# EasyEDA schematic PCBv2.5a.json

## Sheets
1 Headers: TITLE: Sheet_2; REV: 1.0; Date: 2020-05-18; Sheet: 1/1; Drawn By: jacopo.franco333; Company: Your Company
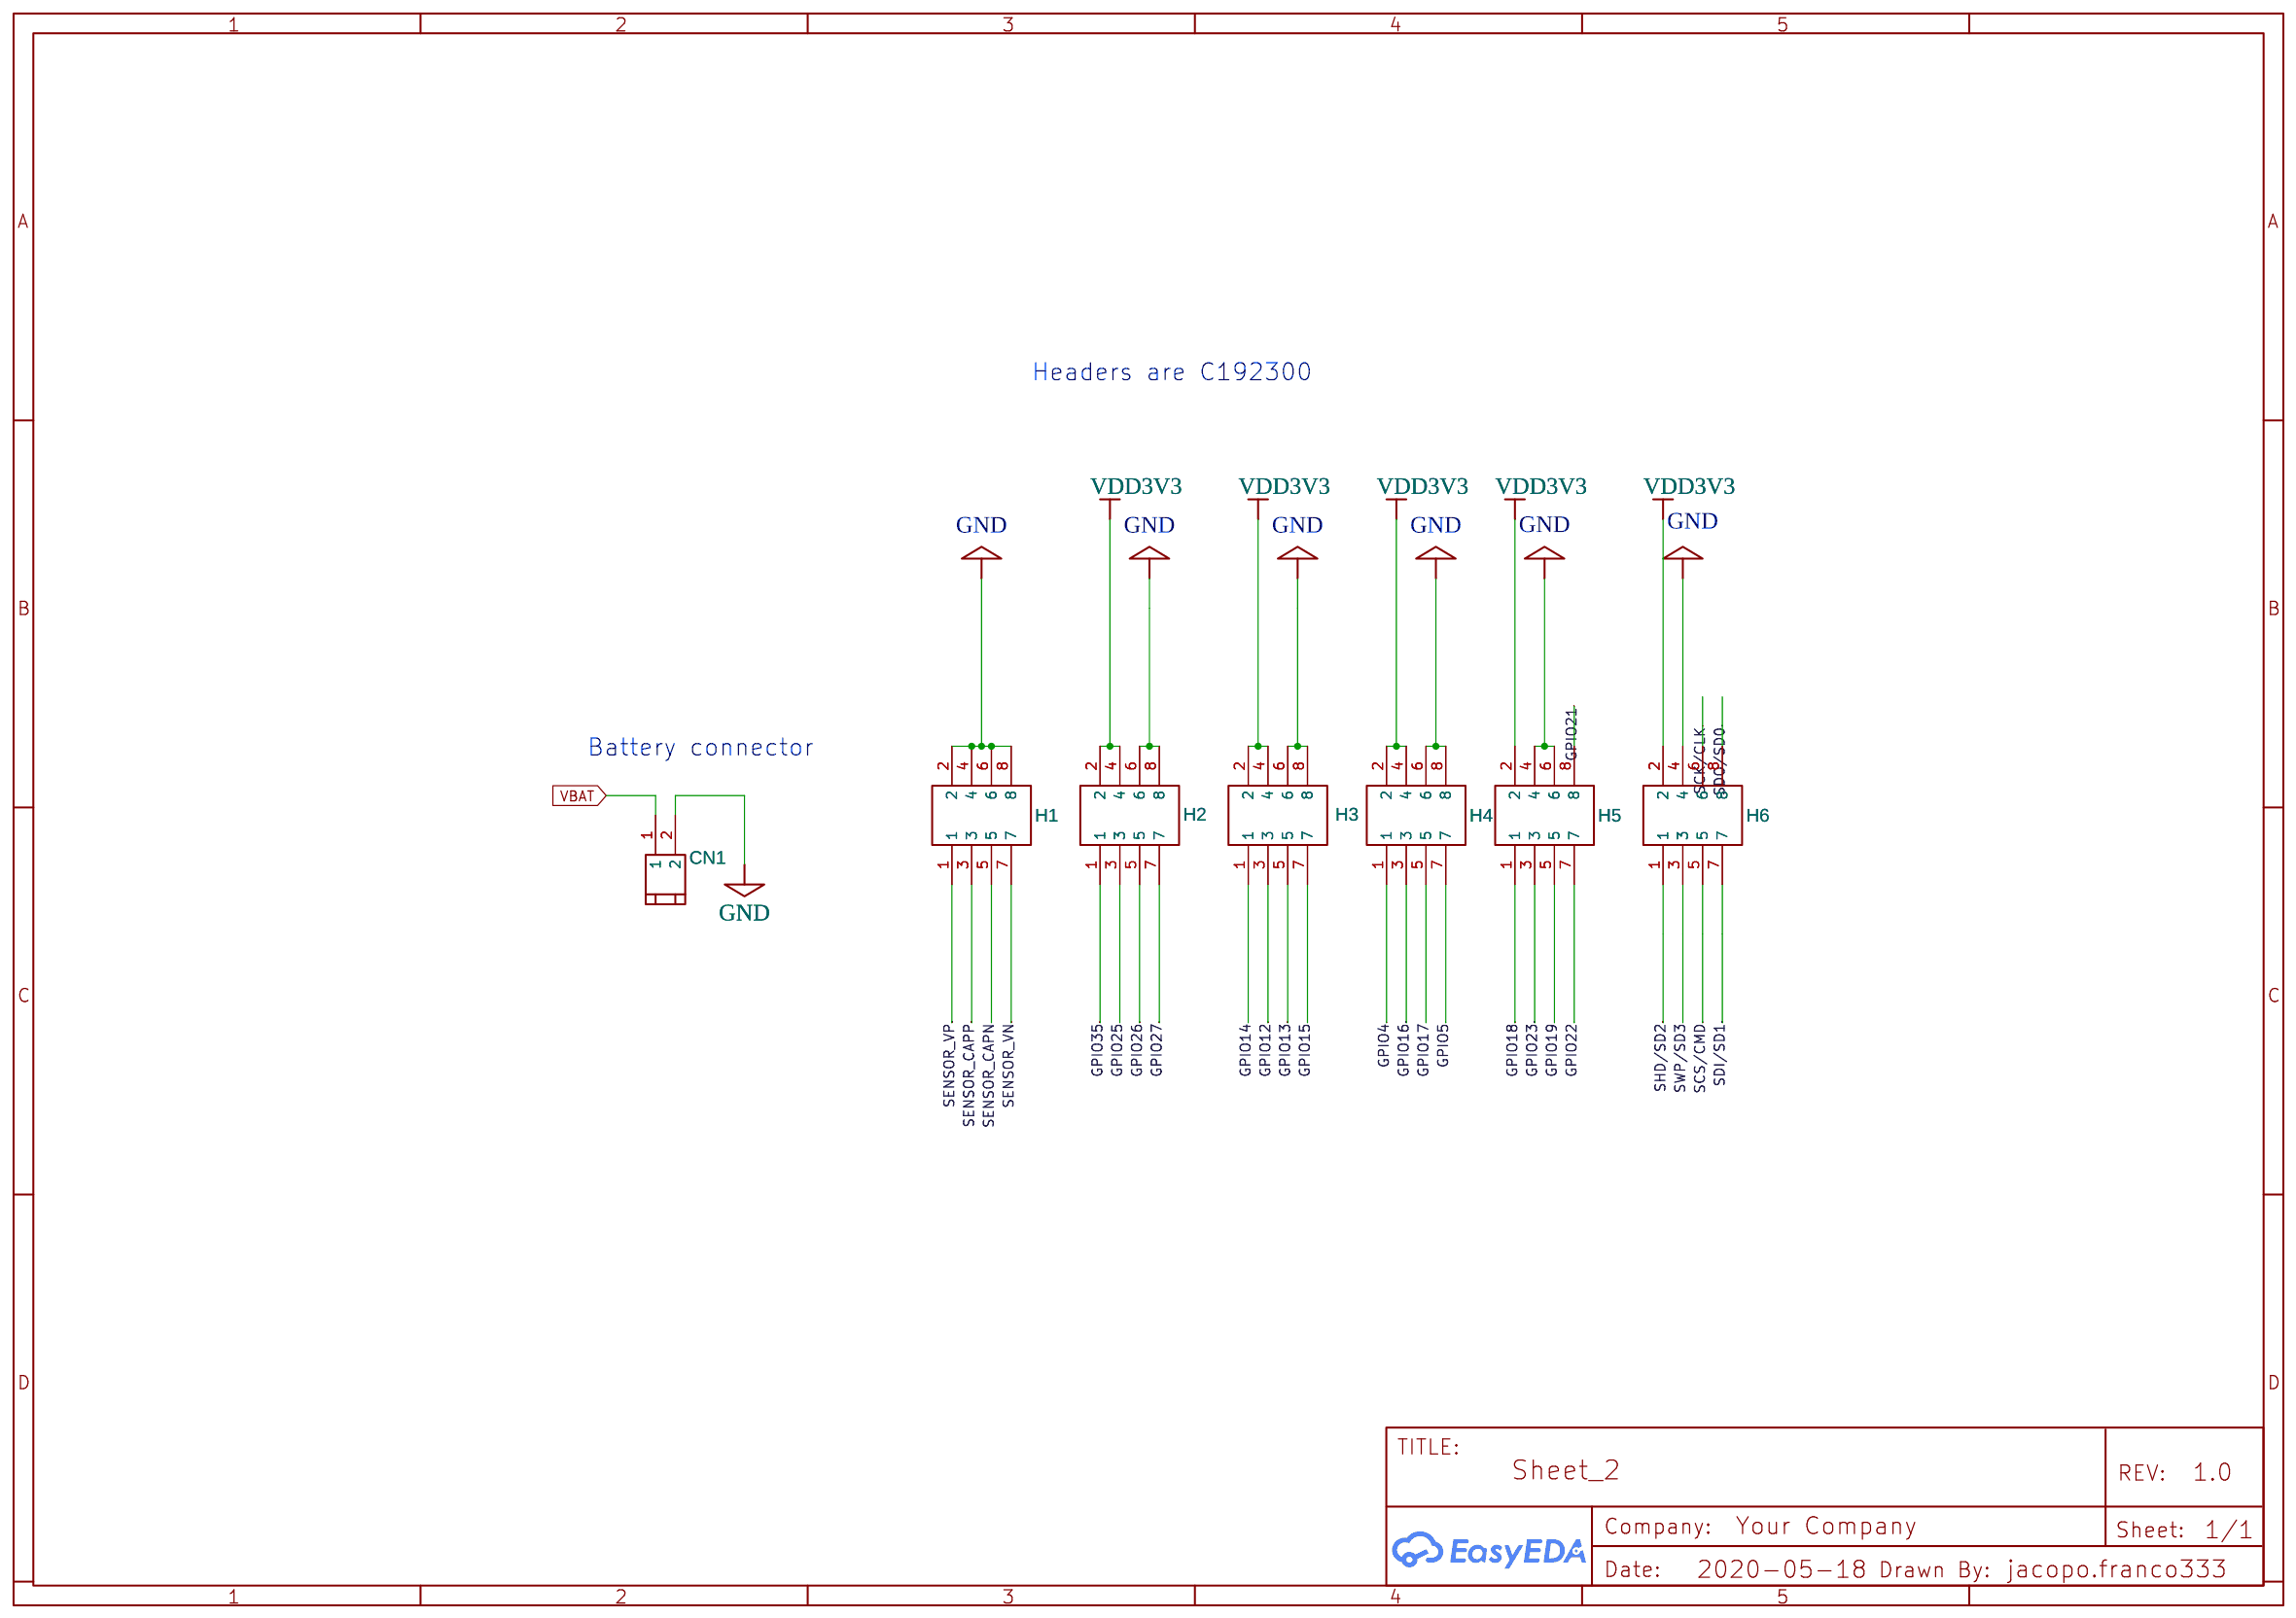
[diagram p0: Headers]
2 ESP32: TITLE: Sheet_1
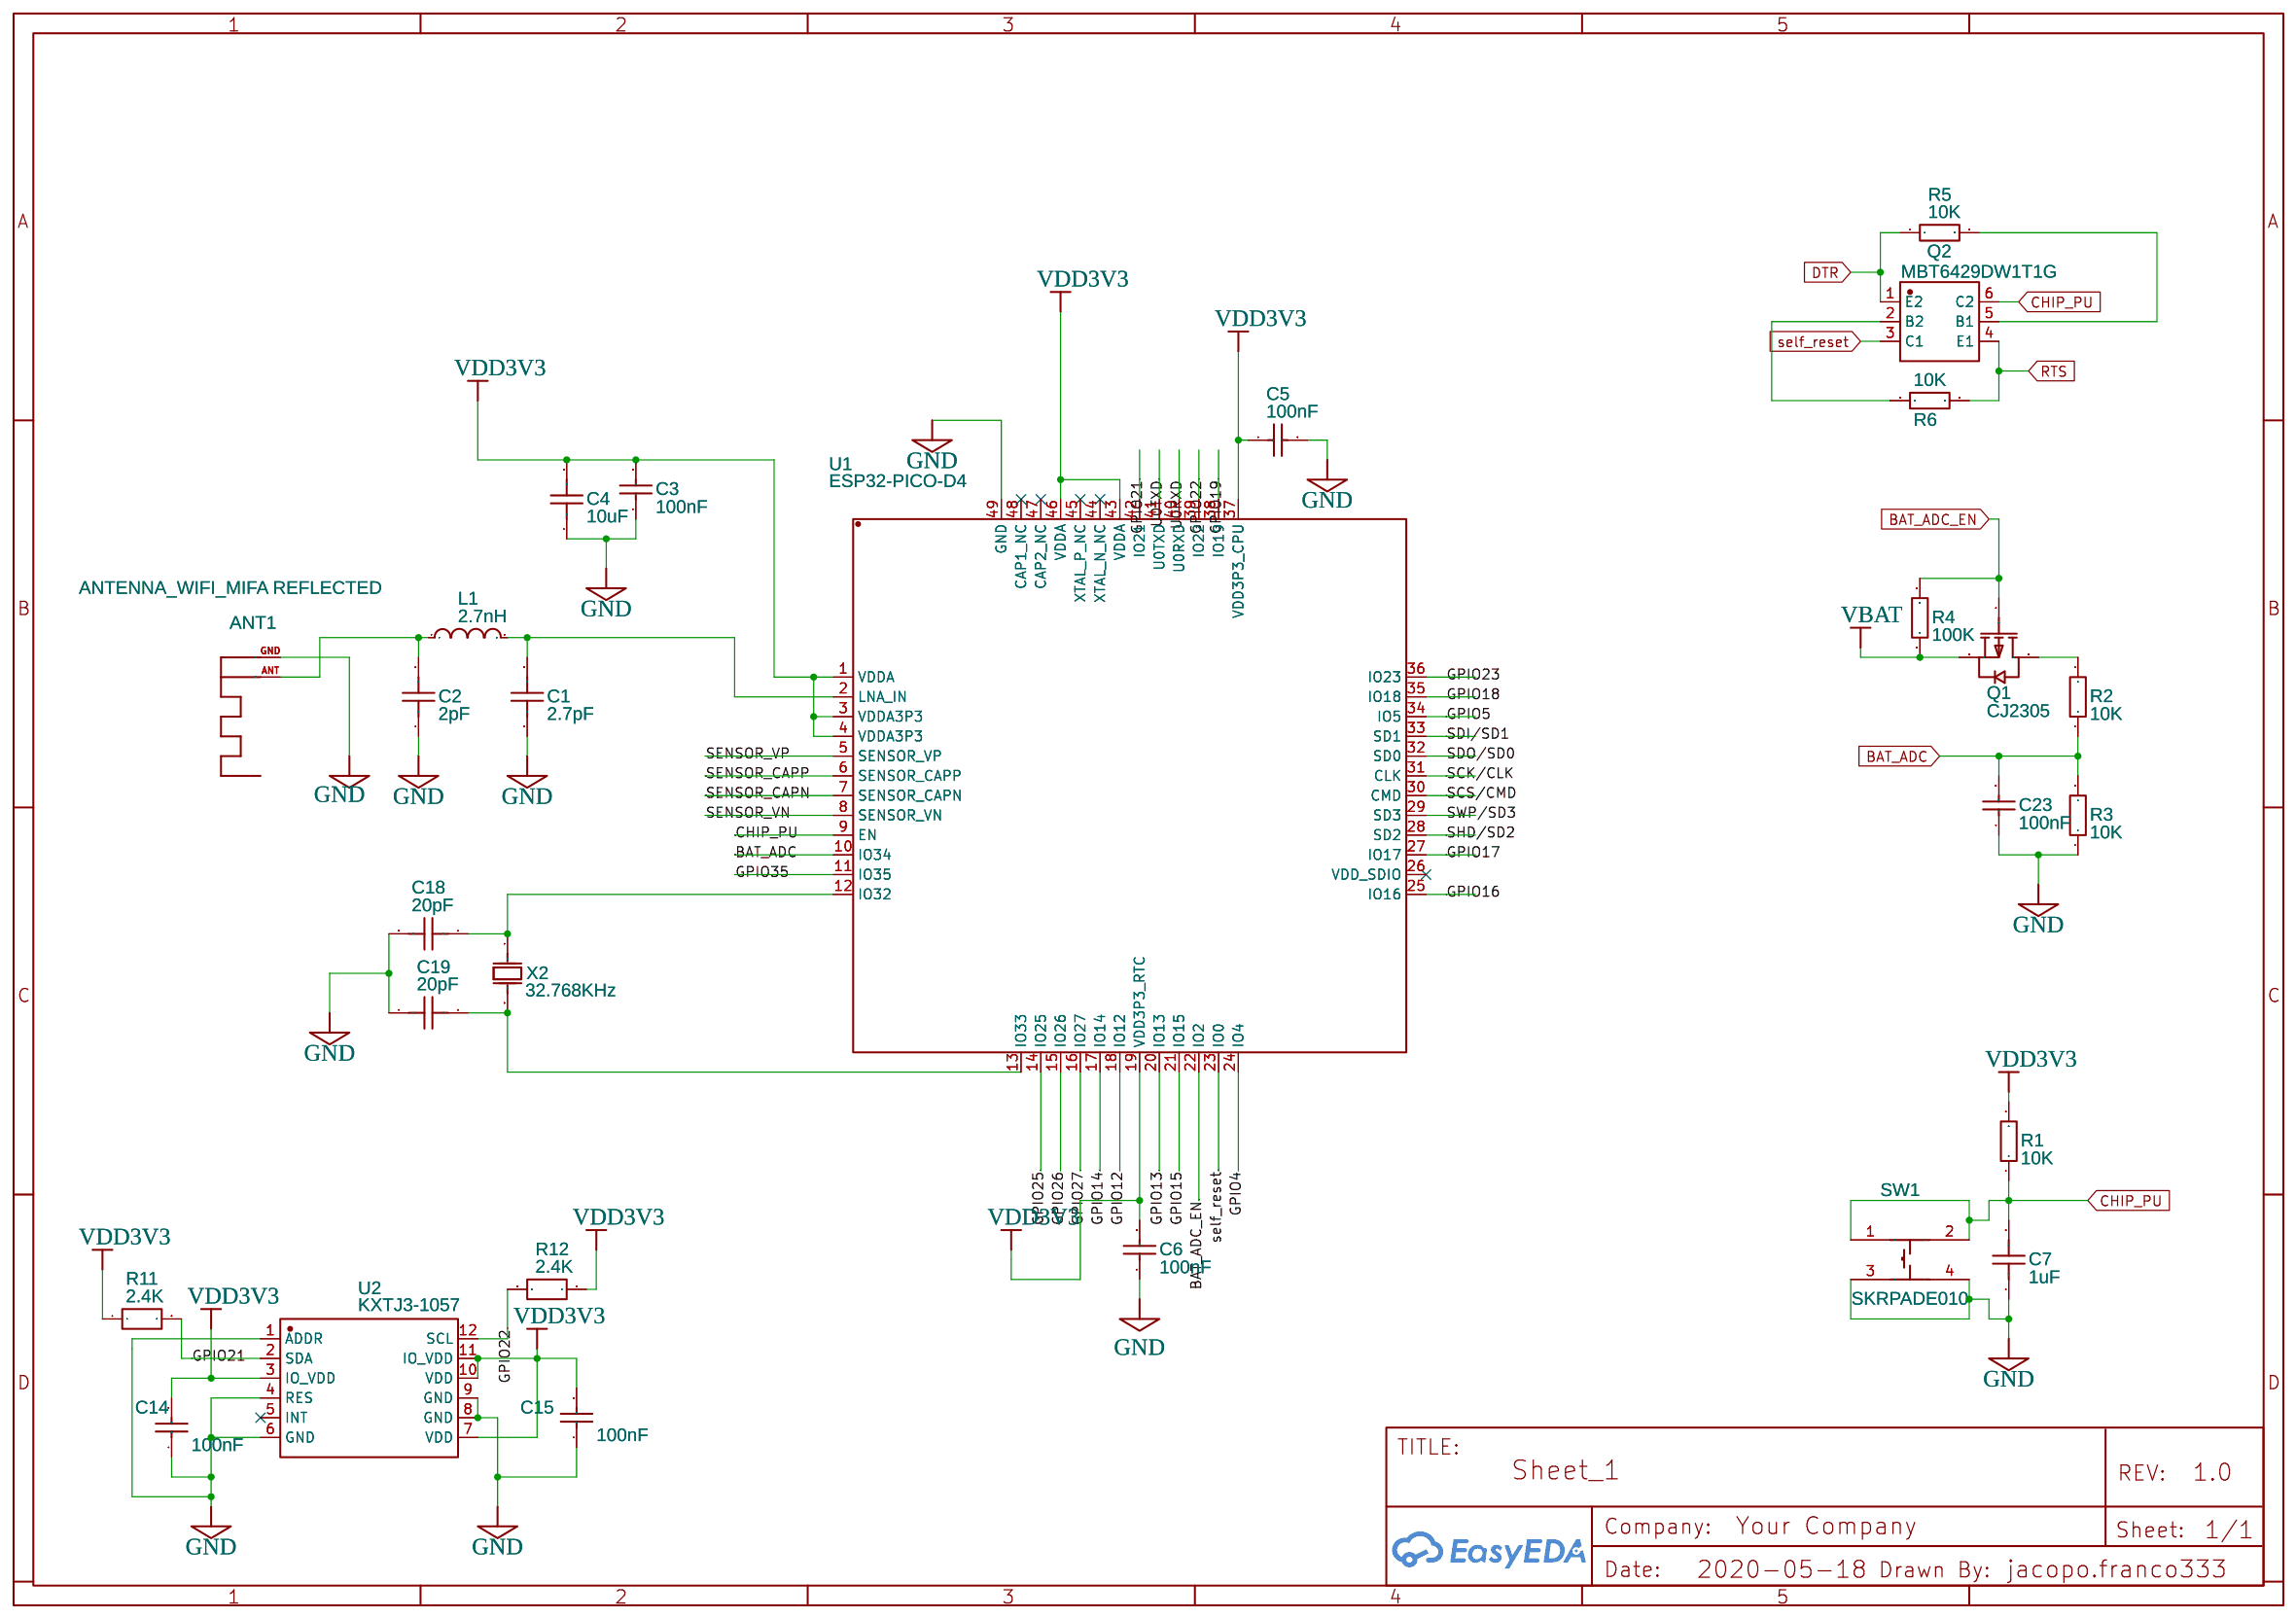
[diagram p1: ESP32]
3 Power, USB: TITLE: Sheet_1
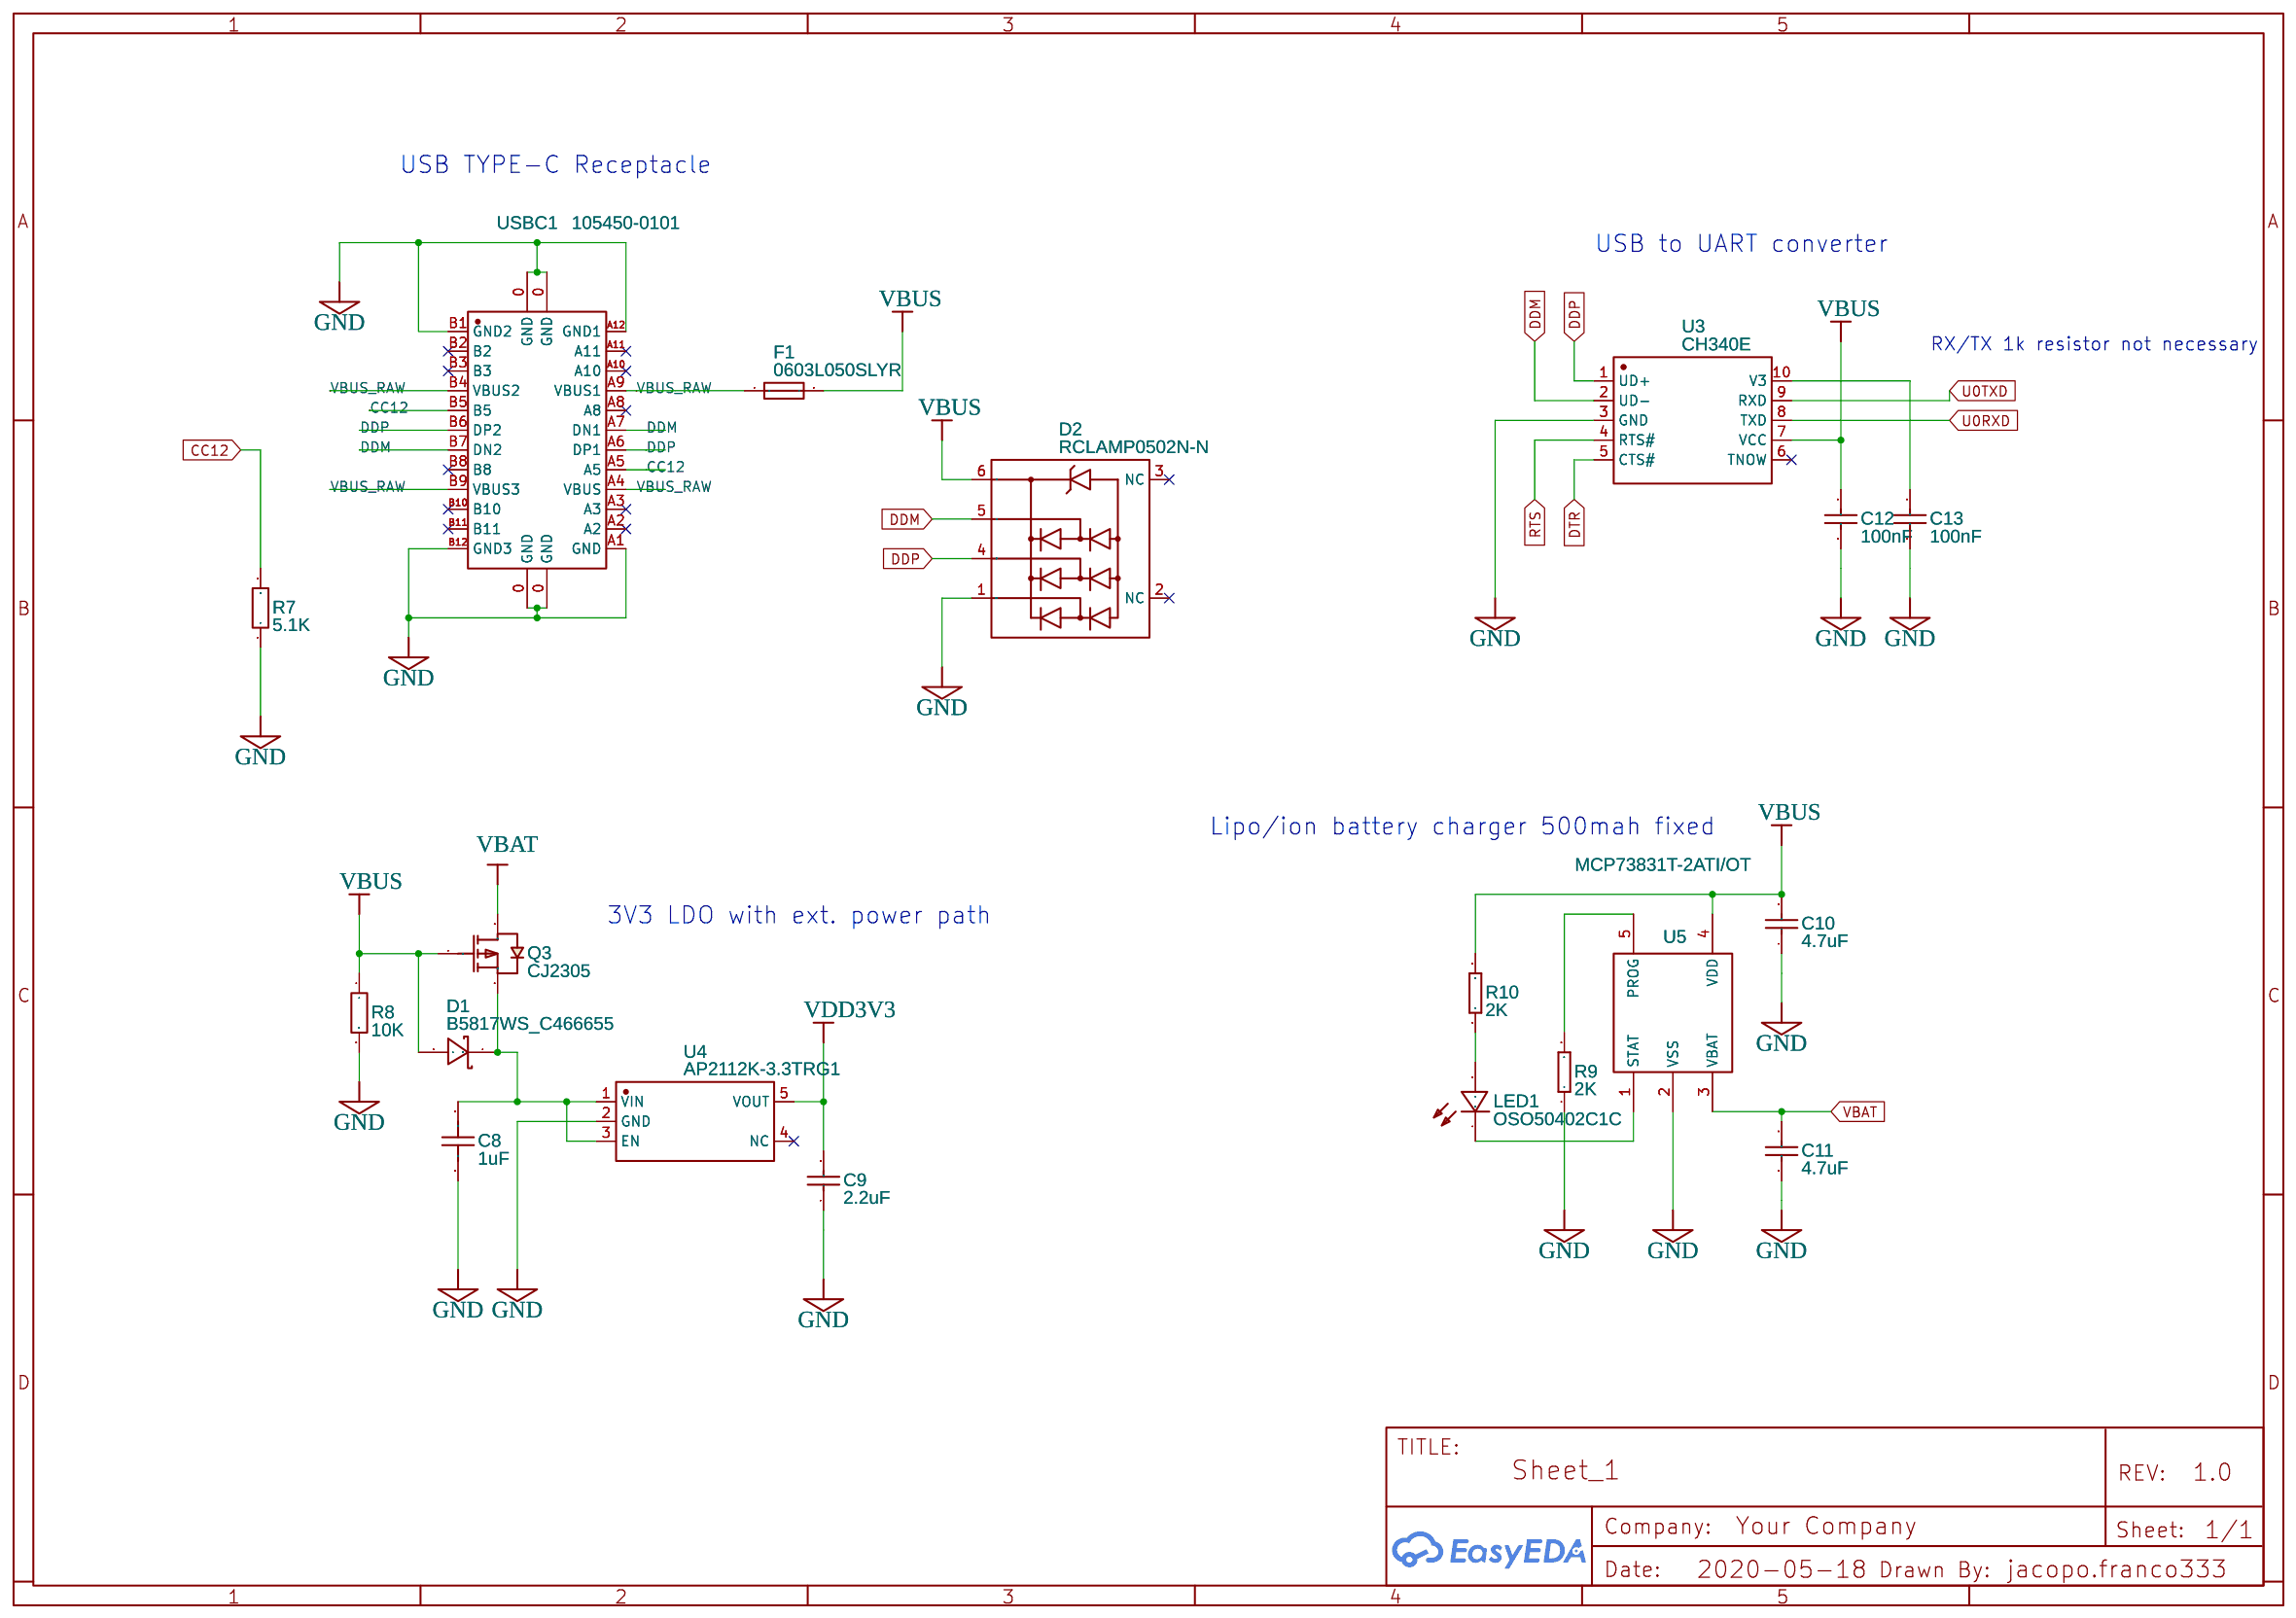
[diagram p2: Power, USB]

## Parts
sheet ESP32
ANT1  ANTENNA_WIFI_MIFA REFLECTED  [WIFI ANTENNA MIFA INVERTED F ANTENNA REFLECTED2]
C1  2.7pF  [C0402]
C2  2pF  [C0402]
C3  100nF  [C0402]
C4  10uF  [C0402]
C5  100nF  [C0402]
C6  100nF  [C0402]
C7  1uF  [C0402]
C14  100nF  [C0402]
C15  100nF  [C0402]
C18  20pF  [C0402]
C19  20pF  [C0402]
C23  100nF  [C0402]
L1  2.7nH  [L0402]
Q1  CJ2305  [SOT-23-3_L2.9-W1.3-P1.90-LS2.4-BR]
Q2  MBT6429DW1T1G  [SC-70-6_L2.2-W1.3-P0.65-LS2.1-BL]
R1  10K  [R0402]
R2  10K  [R0402]
R3  10K  [R0402]
R4  100K  [R0402]
R5  10K  [R0402]
R6  10K  [R0402]
R11  2.4K  [R0402]
R12  2.4K  [R0402]
SW1  SKRPADE010  [KEY-SMD_4P-L4.2-W3.2-P2.20-LS4.6]
U1  ESP32-PICO-D4  [QFN-48_L7.0-W7.0-P0.50-BL-EP5.1]
U2  KXTJ3-1057  [LGA-12_L2.0-W2.0-P0.50-BL]
X2  32.768KHz  [OSC-SMD_L3.2-W1.5]
sheet Headers
CN1  XH-2PWB  [CONN-SMD_2P-P2.50_XH-2PWB]
H1  95278-801A08LF  [HDR-SMD_8P-P2.54-V-R2-C4-S7.3]
H2  95278-801A08LF  [HDR-SMD_8P-P2.54-V-R2-C4-S7.3]
H3  95278-801A08LF  [HDR-SMD_8P-P2.54-V-R2-C4-S7.3]
H4  95278-801A08LF  [HDR-SMD_8P-P2.54-V-R2-C4-S7.3]
H5  95278-801A08LF  [HDR-SMD_8P-P2.54-V-R2-C4-S7.3]
H6  95278-801A08LF  [HDR-SMD_8P-P2.54-V-R2-C4-S7.3]
sheet Power, USB
C8  1uF  [C0402]
C9  2.2uF  [C0402]
C10  4.7uF  [C0402]
C11  4.7uF  [C0402]
C12  100nF  [C0402]
C13  100nF  [C0402]
D1  B5817WS_C466655  [SOD-323_L1.8-W1.3-LS2.5-RD]
D2  RCLAMP0502N-N  [SLP1210N6_L1.2-W1.0-P0.40-BL]
F1  0603L050SLYR  [F0603]
LED1  OSO50402C1C  [LED0402-RD]
Q3  CJ2305  [SOT-23-3_L2.9-W1.3-P1.90-LS2.4-BR]
R7  5.1K  [R0402]
R8  10K  [R0402]
R9  2K  [R402]
R10  2K  [R402]
U3  CH340E  [MSOP-10_L3.0-W3.0-P0.50-LS5.0-BL]
U4  AP2112K-3.3TRG1  [SOT-25-5_L3.0-W1.8-P0.95-LS3.0-BL]
U5  MCP73831T-2ATI/OT  [SOT-23-5_L3.0-W1.7-P0.95-LS2.8-BL]
USBC1  105450-0101  [USB-C-SMD_TYPE-C-USB-18]

## Library data of the parts
ANT1 = ANTENNA_WIFI_MIFA REFLECTED: Contributor: Joshua Lloyd
C1 = CC0402CRNPO9BN2R7: Supplier: LCSC; Supplier Part: C277484; Manufacturer: YAGEO; Contributor: LCSC
C2 = GJM1555C1H2R0WB01D: Supplier: LCSC; Manufacturer: MuRata; Supplier Part: C88885
C3 C5 C6 C12-C15 C23 = GCM155R71E104KE02D: Supplier: LCSC; Manufacturer: MuRata; Supplier Part: C126527
C4 = GRM155R61A106ME21D: Supplier: LCSC; Supplier Part: C324476; Manufacturer: Murata Electronics; Contributor: LCSC
C7 C8 = CL05A105KA5NQNC: Supplier: LCSC; Manufacturer: SAMSUNG; LCSC Assembly: Yes; Supplier Part: C52923; SMT Type: Basic
C18 C19 = GCM1555C1H200FA16D: Supplier: LCSC; Supplier Part: C437436; Manufacturer: Murata Electronics; Contributor: LCSC
L1 = MLG1005S2N7BT000: Supplier: LCSC; Supplier Part: C275282; Manufacturer: TDK; Contributor: LCSC
Q1 Q3 = CJ2305: Supplier: LCSC; Manufacturer: CJ; image: //image.lceda.cn/szlcsc/C8549.jpg; Supplier Part: C8549; LCSC Assembly: Yes; SMT Type: Extend
Q2 = MBT6429DW1T1G: Supplier: LCSC; Supplier Part: C463297; Manufacturer: ON Semicon; Contributor: LCSC
R1-R3 R5 R6 R8 = RC0402FR-0710KL: Supplier: LCSC; Manufacturer: YAGEO; Supplier Part: C60490
R4 = 0402WGJ0104TCE: Supplier: LCSC; Manufacturer: UniOhm; Supplier Part: C25530
R11 R12 = 0402WGD2401TCE: Supplier: LCSC; Supplier Part: C407742; Manufacturer: Uniroyal Elec; Contributor: LCSC
SW1 = SKRPADE010: Supplier: LCSC; Manufacturer: ALPS; Contributor: LCSC; Supplier Part: C127488
U1 = ESP32-PICO-D4: Supplier: LCSC; Supplier Part: C193707; Manufacturer: Espressif Systems; Contributor: LCSC; LCSC Assembly: Yes; SMT Type: Extend
U2 = KXTJ3-1057: Supplier: LCSC; Supplier Part: C442603; Manufacturer: ROHM Semicon; Contributor: LCSC; LCSC Assembly: Yes; SMT Type: Extend
X2 = AH03270014: Supplier: LCSC; Supplier Part: C409356; Manufacturer: TXC Corp; Contributor: LCSC
CN1 = XH-2PWB: Supplier: LCSC; Manufacturer: BOOMELE; image: //image.lceda.cn/szlcsc/C64520.jpg; Supplier Part: C64520
H1-H6 = 95278-801A08LF: Supplier: LCSC; Supplier Part: C192300; Manufacturer: Amphenol ICC; Contributor: LCSC
C9 = GRM155R61A225KE95D: Supplier: LCSC; Manufacturer: MuRata; Supplier Part: C77002
C10 C11 = GRM155R61A475KEAAD: Supplier: LCSC; Manufacturer: MuRata; Supplier Part: C77004
D1 = B5817WS_C466655: Supplier: LCSC; Supplier Part: C466655; Manufacturer: High Diode; Manufacturer Part: B5817WS; Contributor: LCSC
D2 = RCLAMP0502N-N: Supplier: LCSC; Supplier Part: C344005; Manufacturer: Bourne Semicon (Shenzhen); Manufacturer Part: Rclamp0502N-N; Contributor: LCSC
F1 = 0603L050SLYR: Supplier: LCSC; Supplier Part: C207014; Manufacturer: Littelfuse; Contributor: LCSC
LED1 = OSO50402C1C: Supplier: LCSC; Supplier Part: C268301; Manufacturer: OptoSupply; Contributor: LCSC
R7 = AR02DTD5101: Supplier: LCSC; Supplier Part: C319557; Manufacturer: Viking Tech; Contributor: LCSC
R9 R10 = RESISTOR-0402: Contributor: DangerousPrototype; Supplier Part: C478870
U3 = CH340E: Supplier: LCSC; Manufacturer: WCH; Supplier Part: C99652; LCSC Assembly: Yes; SMT Type: Extend
U4 = AP2112K-3.3TRG1: Supplier: LCSC; Manufacturer: DIODES; Contributor: LCSC; Supplier Part: C51118; LCSC Assembly: Yes; SMT Type: Extend
U5 = MCP73831T-2ATI/OT: Supplier: LCSC; Manufacturer: MICROCHIP; image: //image.lceda.cn/szlcsc/C14879.jpg; Supplier Part: C14879; LCSC Assembly: Yes; SMT Type: Extend
USBC1 = 105450-0101: Supplier: LCSC; Supplier Part: C134092; Manufacturer: MOLEX; Contributor: LCSC

## Nets
GND: ANT1.GND C1.1 C2.1 C3.1 C4.1 C5.2 C6.1 C7.1 C8.1 C9.1 C10.1 C11.1 C12.1 C13.1 C14.1 C15.1 C18.2 C19.1 C23.1 CN1.2 D2.1(GND) H1.2 H1.4 H1.6 H1.8 H2.6 H2.8 H3.6 H3.8 H4.6 H4.8 H5.4 H5.6 H6.4 R3.1 R7.1 R8.2 R9.1 SW1.3 SW1.4 U1.49(GND) U2.1(ADDR) U2.4(RES) U2.6(GND) U2.8(GND) U2.9(GND) U3.3(GND) U4.2(GND) U5.2(VSS) USBC1.0(GND) USBC1.A1(GND) USBC1.A12(GND1) USBC1.B1(GND2) USBC1.B12(GND3)
VBAT: C11.2 CN1.1 Q1.2(S) Q3.3(D) R4.1 U5.3(VBAT)
VBUS: C10.2 C12.2 D1.2(A) D2.6(VBUS) F1.2 Q3.1(G) R8.1 R10.2 U3.7(VCC) U5.4(VDD)
VBUS_RAW: F1.1 USBC1.A4(VBUS) USBC1.A9(VBUS1) USBC1.B4(VBUS2) USBC1.B9(VBUS3)
VDD3V3: C3.2 C4.2 C5.1 C6.2 C9.2 C14.2 C15.2 H2.2 H2.4 H3.2 H3.4 H4.2 H4.4 H5.2 H6.2 R1.2 R11.1 R12.1 U1.1(VDDA) U1.3(VDDA3P3) U1.4(VDDA3P3) U1.19(VDD3P3_RTC) U1.37(VDD3P3_CPU) U1.43(VDDA) U1.46(VDDA) U2.3(IO_VDD) U2.7(VDD) U2.10(VDD) U2.11(IO_VDD) U4.5(VOUT)
BAT_ADC: C23.2 R2.1 R3.2 U1.10(IO34)
BAT_ADC_EN: Q1.1(G) R4.2 U1.22(IO2)
CC12: R7.2 USBC1.A5 USBC1.B5
CHIP_PU: C7.2 Q2.6(C2) R1.1 SW1.1 SW1.2 U1.9(EN)
DDM: D2.5(I/O) U3.2(UD-) USBC1.A7(DN1) USBC1.B7(DN2)
DDP: D2.4(I/O) U3.1(UD+) USBC1.A6(DP1) USBC1.B6(DP2)
DTR: Q2.1(E2) R5.1 U3.5(CTS#)
GPIO4: H4.1 U1.24(IO4)
GPIO5: H4.7 U1.34(IO5)
GPIO12: H3.3 U1.18(IO12)
GPIO13: H3.5 U1.20(IO13)
GPIO14: H3.1 U1.17(IO14)
GPIO15: H3.7 U1.21(IO15)
GPIO16: H4.3 U1.25(IO16)
GPIO17: H4.5 U1.27(IO17)
GPIO18: H5.1 U1.35(IO18)
GPIO19: H5.5 U1.38(IO19)
GPIO21: H5.8 R11.2 U1.42(IO21) U2.2(SDA)
GPIO22: H5.7 R12.2 U1.39(IO22) U2.12(SCL)
GPIO23: H5.3 U1.36(IO23)
GPIO25: H2.3 U1.14(IO25)
GPIO26: H2.5 U1.15(IO26)
GPIO27: H2.7 U1.16(IO27)
GPIO35: H2.1 U1.11(IO35)
RTS: Q2.4(E1) R6.2 U3.4(RTS#)
SCK/CLK: H6.6 U1.31(CLK)
SCS/CMD: H6.5 U1.30(CMD)
SDI/SD1: H6.7 U1.33(SD1)
SDO/SD0: H6.8 U1.32(SD0)
self_reset: Q2.3(C1) U1.23(IO0)
SENSOR_CAPN: H1.5 U1.7(SENSOR_CAPN)
SENSOR_CAPP: H1.3 U1.6(SENSOR_CAPP)
SENSOR_VN: H1.7 U1.8(SENSOR_VN)
SENSOR_VP: H1.1 U1.5(SENSOR_VP)
SHD/SD2: H6.1 U1.28(SD2)
SWP/SD3: H6.3 U1.29(SD3)
U0RXD: U1.40(U0RXD) U3.8(TXD)
U0TXD: U1.41(U0TXD) U3.9(RXD)
Net-(ANT1-ANT): ANT1.ANT C2.2 L1.1
Net-(C1-2): C1.2 L1.2 U1.2(LNA_IN)
Net-(C8-2): C8.2 D1.1(C) Q3.2(S) U4.1(VIN) U4.3(EN)
Net-(C13-2): C13.2 U3.10(V3)
Net-(C18-1): C18.1 U1.12(IO32) X2.1(OSC1)
Net-(C19-2): C19.2 U1.13(IO33) X2.2(OSC2)
Net-(LED1-1): LED1.1(C) U5.1(STAT)
Net-(LED1-2): LED1.2(A) R10.1
Net-(Q1-3): Q1.3(D) R2.2
Net-(Q2-2): Q2.2(B2) R6.1
Net-(Q2-5): Q2.5(B1) R5.2
Net-(R9-2): R9.2 U5.5(PROG)

Not connected (* = marked no-connect by the designer): D2 2(NC)* 3(NC)*; U1 26(VDD_SDIO)* 44(XTAL_N_NC)* 45(XTAL_P_NC)* 47(CAP2_NC)* 48(CAP1_NC)*; U2 5(INT)*; U3 6(TNOW)*; U4 4(NC)*; USBC1 A2* A3* A8* A10* A11* B2* B3* B8* B10* B11*

## Notes on the sheets
sheet 1
- Headers are C192300
- Battery connector
sheet 3
- USB TYPE-C Receptacle
- USB to UART converter
- RX/TX 1k resistor not necessary
- Lipo/ion battery charger 500mah fixed
- 3V3 LDO with ext. power path
